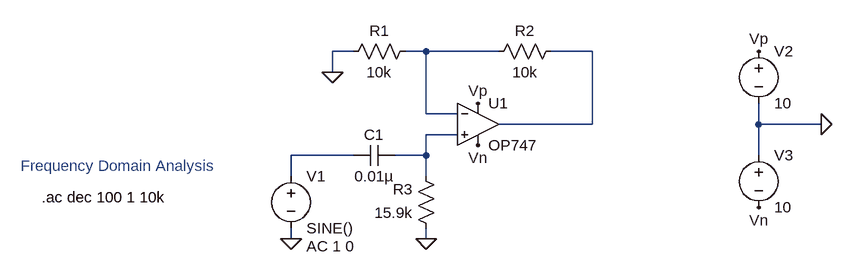
[diagram p0: schematic high_pass_filter.asc]
high_pass_filter.asc, the LTspice schematic file:
Version 4
SHEET 1 880 680
WIRE 0 32 -32 32
WIRE 112 32 80 32
WIRE 224 32 112 32
WIRE 368 32 304 32
WIRE -32 64 -32 32
WIRE 112 128 112 32
WIRE 160 128 112 128
WIRE 368 144 368 32
WIRE 368 144 224 144
WIRE 624 144 624 112
WIRE 720 144 624 144
WIRE 160 160 112 160
WIRE 0 192 -96 192
WIRE 112 192 112 160
WIRE 112 192 64 192
WIRE 624 192 624 144
WIRE -96 224 -96 192
WIRE 112 224 112 192
WIRE -96 320 -96 304
WIRE 112 320 112 304
FLAG -32 64 0
FLAG -96 320 0
FLAG 112 320 0
FLAG 720 144 0
FLAG 624 32 Vp
FLAG 192 112 Vp
FLAG 624 272 Vn
FLAG 192 176 Vn
SYMBOL OpAmps\\OP747 192 80 R0
SYMATTR InstName U1
SYMBOL cap 64 176 R90
WINDOW 0 0 32 VBottom 2
WINDOW 3 32 32 VTop 2
SYMATTR InstName C1
SYMATTR Value 0.01µ
SYMBOL res 96 16 R90
WINDOW 0 0 56 VBottom 2
WINDOW 3 32 56 VTop 2
SYMATTR InstName R1
SYMATTR Value 10k
SYMBOL res 320 16 R90
WINDOW 0 0 56 VBottom 2
WINDOW 3 32 56 VTop 2
SYMATTR InstName R2
SYMATTR Value 10k
SYMBOL res 128 320 R180
WINDOW 0 36 76 Left 2
WINDOW 3 36 40 Left 2
SYMATTR InstName R3
SYMATTR Value 15.9k
SYMBOL voltage -96 208 R0
WINDOW 123 24 124 Left 2
WINDOW 39 0 0 Left 0
SYMATTR InstName V1
SYMATTR Value SINE()
SYMATTR Value2 AC 1 0
SYMBOL voltage 624 16 R0
WINDOW 123 0 0 Left 0
WINDOW 39 0 0 Left 0
SYMATTR InstName V2
SYMATTR Value 10
SYMBOL voltage 624 176 R0
WINDOW 123 0 0 Left 0
WINDOW 39 0 0 Left 0
SYMATTR InstName V3
SYMATTR Value 10
TEXT -480 256 Left 2 !.ac dec 100 1 10k
TEXT -512 208 Left 2 ;Frequency Domain Analysis

The netlist it stands for:
* high_pass_filter.asc
XU1 N003 N001 Vp Vn N002 OP747  ; pins In+ In- V+ V- OUT
C1 N003 N004 0.01µ
R1 N001 0 10k
R2 N002 N001 10k
R3 0 N003 15.9k
V1 N004 0 SINE() AC 1 0
V2 Vp 0 10
V3 0 Vn 10
.ac dec 100 1 10k
* Frequency Domain Analysis
.backanno
.end